# Altium schematic sheet wled4.SchDoc
size A4
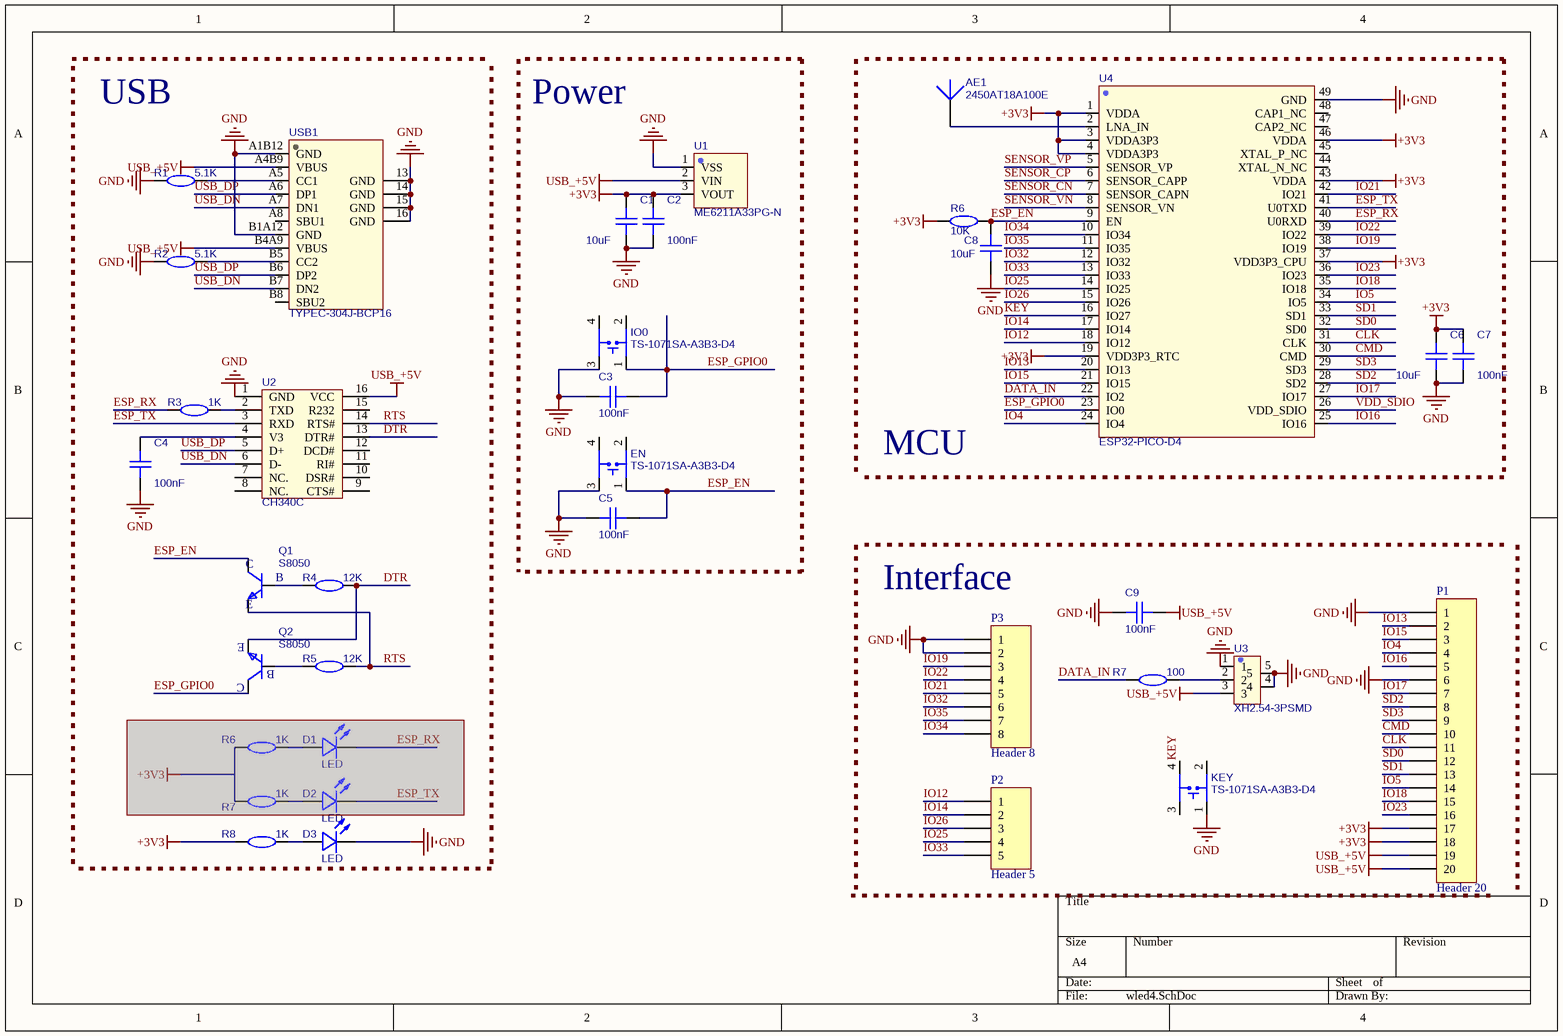
[diagram p0: wled4.SchDoc]

## Parts
(Parts that share a designator on the sheet are numbered #1, #2 ... from top to bottom, then left to right.)
AE1  2450AT18A100E  [ANT-SMD_L3.2-W1.6]
C1  10uF  [C0603]
C2  100nF  [C0603]
C3  100nF  [C0603]
C4  100nF  [C0603]
C5  100nF  [C0603]
C6  10uF  [C0603]
C7  100nF  [C0603]
C8  10uF  [C0603]
C9  100nF  [C0603]
D1  LED  [LED-0603]  (masked out: inside a compile mask, not in the netlist)
D2  LED  [LED-0603]  (masked out: inside a compile mask, not in the netlist)
D3  LED  [LED-0603]
EN  TS-1071SA-A3B3-D4  [KEY-SMD_4P-L3.5-W3.0-P1.40-LS4.6]
IO0  TS-1071SA-A3B3-D4  [KEY-SMD_4P-L3.5-W3.0-P1.40-LS4.6]
KEY  TS-1071SA-A3B3-D4  [KEY-SMD_4P-L3.5-W3.0-P1.40-LS4.6]
P1  Header 20  [HDR1X20]
P2  Header 5  [HDR1X5]
P3  Header 8  [HDR1X8]
Q1  S8050  [SOT-23_L2.9-W1.3-P0.95-LS2.4-BR]
Q2  S8050  [SOT-23_L2.9-W1.3-P0.95-LS2.4-BR]
R1  5.1K  [R0603]
R2  5.1K  [R0603]
R3  1K  [R0603]
R4  12K  [R0603]
R5  12K  [R0603]
R6#1  10K  [R0603]
R6#2  1K  [R0603]  (masked out: inside a compile mask, not in the netlist)
R7#1  100  [R0603]
R7#2  1K  [R0603]  (masked out: inside a compile mask, not in the netlist)
R8  1K  [R0603]
U1  ME6211A33PG-N  [SOT-89_L4.5-W2.5-P1.50-LS4.2-BR]
U2  CH340C  [SOP-16_L10.0-W3.9-P1.27-LS6.0-BL]
U3  XH2.54-3PSMD  [CONN-SMD_XH2.54-3PSMD]
U4  ESP32-PICO-D4  [QFN-48_L7.0-W7.0-P0.50-BL-EP5.4]
USB1  TYPEC-304J-BCP16  [USB-C-SMD_TYPEC-304J-BCP16]

## Nets
+3V3: C1.2 C2.2 C6.2 C7.2 P1.17 P1.18 R6#1.1 R8.2 U1.3(VOUT) U4.1(VDDA) U4.3(VDDA3P3) U4.4(VDDA3P3) U4.19(VDD3P3_RTC) U4.37(VDD3P3_CPU) U4.43(VDDA) U4.46(VDDA)
GND: C1.1 C2.1 C3.2 C4.1 C5.2 C6.1 C7.1 C8.2 C9.2 D3.2(K) EN.3 IO0.3 KEY.1 P1.1 P1.6 P3.1 P3.2 R1.2 R2.2 U1.1(VSS) U2.1(GND) U3.1 U3.4 U3.5 U4.49(GND) USB1.13(GND) USB1.14(GND) USB1.15(GND) USB1.16(GND) USB1.A1B12(GND) USB1.B1A12(GND)
USB_+5V: C9.1 P1.19 P1.20 U1.2(VIN) U2.16(VCC) U3.3 USB1.A4B9(VBUS) USB1.B4A9(VBUS)
CLK: P1.11 U4.31(CLK)
CMD: P1.10 U4.30(CMD)
DATA_IN: R7#1.2 U4.22(IO2)
DTR: Q2.2(E) R4.1 U2.13(DTR#)
ESP_EN: C5.1 C8.1 EN.1 Q1.3(C) R6#1.2 U4.9(EN)
ESP_GPIO0: C3.1 IO0.1 Q2.3(C) U4.23(IO0)
ESP_RX: R3.2 U4.40(U0RXD)
ESP_TX: U2.3(RXD) U4.41(U0TXD)
IO4: P1.4 U4.24(IO4)
IO5: P1.14 U4.34(IO5)
IO12: P2.1 U4.18(IO12)
IO13: P1.2 U4.20(IO13)
IO14: P2.2 U4.17(IO14)
IO15: P1.3 U4.21(IO15)
IO16: P1.5 U4.25(IO16)
IO17: P1.7 U4.27(IO17)
IO18: P1.15 U4.35(IO18)
IO19: P3.3 U4.38(IO19)
IO21: P3.5 U4.42(IO21)
IO22: P3.4 U4.39(IO22)
IO23: P1.16 U4.36(IO23)
IO25: P2.4 U4.14(IO25)
IO26: P2.3 U4.15(IO26)
IO32: P3.6 U4.12(IO32)
IO33: P2.5 U4.13(IO33)
IO34: P3.8 U4.10(IO34)
IO35: P3.7 U4.11(IO35)
KEY: KEY.4 U4.16(IO27)
RTS: Q1.2(E) R5.1 U2.14(RTS#)
SD0: P1.12 U4.32(SD0)
SD1: P1.13 U4.33(SD1)
SD2: P1.8 U4.28(SD2)
SD3: P1.9 U4.29(SD3)
SENSOR_CN: U4.7(SENSOR_CAPN)
SENSOR_CP: U4.6(SENSOR_CAPP)
SENSOR_VN: U4.8(SENSOR_VN)
SENSOR_VP: U4.5(SENSOR_VP)
USB_DN: U2.6(D-) USB1.A7(DN1) USB1.B7(DN2)
USB_DP: U2.5(D+) USB1.A6(DP1) USB1.B6(DP2)
VDD_SDIO: U4.26(VDD_SDIO)
NetAE1_1: AE1.1(ANT) U4.2(LNA_IN)
NetC4_2: C4.2 U2.4(V3)
NetD3_1: D3.1(A) R8.1
NetQ1_1: Q1.1(B) R4.2
NetQ2_1: Q2.1(B) R5.2
NetR1_1: R1.1 USB1.A5(CC1)
NetR2_1: R2.1 USB1.B5(CC2)
NetR3_1: R3.1 U2.2(TXD)
NetR7#1_1: R7#1.1 U3.2

Not connected (* = marked no-connect by the designer): AE1 2; EN 2 4; IO0 2 4; KEY 2 3; U2 7(NC.) 8(NC.) 9(CTS#) 10(DSR#) 11(RI#) 12(DCD#) 15(R232); U4 44(XTAL_N_NC) 45(XTAL_P_NC) 47(CAP2_NC) 48(CAP1_NC); USB1 A8(SBU1) B8(SBU2)

## Notes on the sheet
- USB
- Power
- MCU
- (near P3) Interface

## Library data of the parts
AE1 = 2450AT18A100E: BOM_Manufacturer: Johanson Dielectrics; Contributor: LCSC; BOM_Supplier: LCSC; BOM_Supplier Part: C89334; BOM_Manufacturer Part: 2450AT18A100E; BOM_JLCPCB Part Class: Extended Part; spicePre: A; spiceSymbolName: 2450AT18A100E
C1-C9 = CAP_0603: BOM_Manufacturer: YAGEO; BOM_Manufacturer Part: CC0603GRNPO9BN200; nameAlias: Capacitance; Contributor: LCSC; BOM_Supplier: LCSC; BOM_Supplier Part: C325469; spicePre: C; spiceSymbolName: CC0603GRNPO9BN200
D1-D3 = LED-Y: nameAlias: Model; BOM_Manufacturer Part: ?; spicePre: D; spiceSymbolName: LED
EN IO0 KEY = TS-1071SA-A3B3-D4: BOM_Manufacturer: Yuandi; Contributor: LCSC; BOM_Supplier: LCSC; BOM_Supplier Part: C498309; BOM_Manufacturer Part: TS-1071SA-A3B3-D4; BOM_JLCPCB Part Class: Extended Part; spicePre: S; spiceSymbolName: TS-1071SA-A3B3-D4
P1 = Header 20: Header, 20-Pin; LatestRevisionDate: 17-Jul-2002; LatestRevisionNote: Re-released for DXP Platform.; Publisher: Altium Limited
P2 = Header 5: Header, 5-Pin; LatestRevisionDate: 17-Jul-2002; LatestRevisionNote: Re-released for DXP Platform.; Publisher: Altium Limited
P3 = Header 8: Header, 8-Pin; LatestRevisionDate: 17-Jul-2002; LatestRevisionNote: Re-released for DXP Platform.; Publisher: Altium Limited
Q1 Q2 = S8050: BOM_Manufacturer: GreenPower; Contributor: LCSC; BOM_Supplier: LCSC; BOM_Supplier Part: C414195; BOM_Manufacturer Part: S8050; spicePre: Q; spiceSymbolName: S8050_C414195
R1-R5 R6#1 R6#2 R7#1 R7#2 R8 = RES_0603: BOM_Manufacturer: LIZ; BOM_Manufacturer Part: CR0603JA0301G; nameAlias: Resistance (Ohms); BOM_Supplier: LCSC; BOM_Supplier Part: C101323; spicePre: R; spiceSymbolName: CR0603JA0301G
U1 = ME6211A33PG-N: BOM_Manufacturer: Nanjing Micro One Elec; Contributor: LCSC; BOM_Supplier: LCSC; BOM_Supplier Part: C236673; BOM_Manufacturer Part: ME6211A33PG-N; BOM_JLCPCB Part Class: Extended Part; spicePre: U; spiceSymbolName: ME6211A33PG-N
U2 = CH340C: BOM_Manufacturer: WCH; BOM_Supplier: LCSC; BOM_Manufacturer Part: CH340C; BOM_Supplier Part: C84681; BOM_JLCPCB Part Class: Extended Part; spicePre: U; spiceSymbolName: CH340C
U3 = XH2.54-3PSMD: BOM_Manufacturer: null; Contributor: LCSC; BOM_Supplier: LCSC; BOM_Supplier Part: C9900001013; BOM_Manufacturer Part: XH2.54-3PSMD; BOM_JLCPCB Part Class: Extended Part; link: https://cn.bing.com/search?q=datasheet: XH2.54-3PSMD; spicePre: U; spiceSymbolName: XH2.54-3PSMD
U4 = ESP32-PICO-D4: BOM_Manufacturer: Espressif Systems; Contributor: LCSC; BOM_Supplier: LCSC; BOM_Supplier Part: C193707; BOM_Manufacturer Part: ESP32-PICO-D4; BOM_JLCPCB Part Class: Extended Part; Frequency: -; spicePre: U; spiceSymbolName: ESP32-PICO-D4
USB1 = TYPEC-304J-BCP16: BOM_Manufacturer: XUNPU(讯普); Contributor: LCSC; BOM_Supplier: LCSC; BOM_Supplier Part: C2835315; BOM_Manufacturer Part: TYPEC-304J-BCP16; BOM_JLCPCB Part Class: Extended Part; spicePre: U; spiceSymbolName: TYPEC-304J-BCP16